# Altium schematic sheet POWER.SchDoc
size A3; SheetNumber: 1; SheetTotal: 3
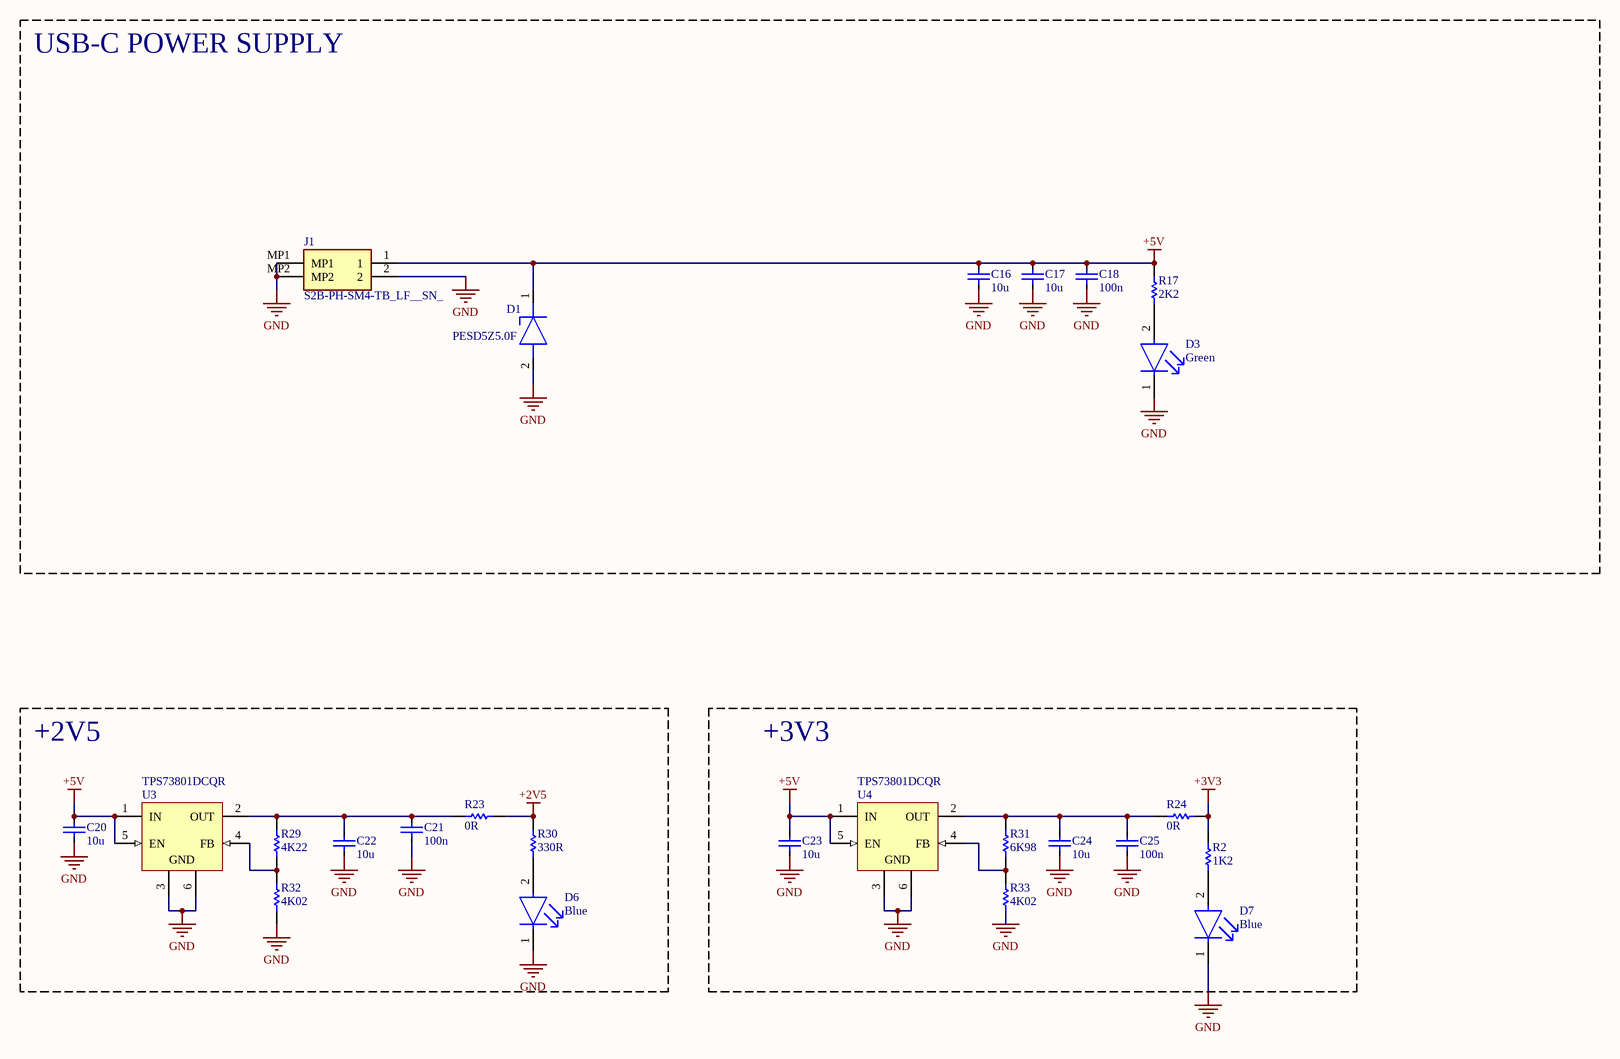
[diagram p0: POWER.SchDoc]

## Parts
C16  value 10u  [FP-C1608-080-0_1-IPC_C]  (hidden comment: C1608JB0J106K080AB)
C17  value 10u  [FP-C1608-080-0_1-IPC_C]  (hidden comment: C1608JB0J106K080AB)
C18  value 100n  [FP-C1005-050-0_05-IPC_C]  (hidden comment: C1005X7R1H104K050BB)
C20  value 10u  [FP-C1608-080-0_1-IPC_C]  (hidden comment: C1608JB0J106K080AB)
C21  value 100n  [FP-C1005-050-0_05-IPC_C]  (hidden comment: C1005X7R1H104K050BB)
C22  value 10u  [FP-C1608-080-0_1-IPC_C]  (hidden comment: C1608JB0J106K080AB)
C23  value 10u  [FP-C1608-080-0_1-IPC_C]  (hidden comment: C1608JB0J106K080AB)
C24  value 10u  [FP-C1608-080-0_1-IPC_C]  (hidden comment: C1608JB0J106K080AB)
C25  value 100n  [FP-C1005-050-0_05-IPC_C]  (hidden comment: C1005X7R1H104K050BB)
D1  PESD5Z5.0F  [SODFL1608X65N]
D3  Color: Green  [FP-LTST-C191GKT-MFG]  (hidden comment: LTST-C191GKT)
D6  Color: Blue  [FP-LTST-C191TBKT-MFG]  (hidden comment: LTST-C191TBKT)
D7  Color: Blue  [FP-LTST-C191TBKT-MFG]  (hidden comment: LTST-C191TBKT)
J1  S2B-PH-SM4-TB_LF__SN_  [S2BPHSM4TBLFSN]
R2  value 1K2  [RESC1005X40X25ML05T10]  (hidden comment: RC0402FR-071K2L)
R17  value 2K2  [RESC1005X40X25NL05T10]  (hidden comment: RC0402FR-072K2L)
R23  value 0R  [RESC1005X40X25NL05T10]  (hidden comment: RC0402FR-070RL)
R24  value 0R  [RESC1005X40X25NL05T10]  (hidden comment: RC0402FR-070RL)
R29  value 4K22  [RESC1005X40X25ML05T10]  (hidden comment: RC0402FR-074K22L)
R30  value 330R  [RESC1005X40X25ML05T10]  (hidden comment: RC0402FR-07330RL)
R31  value 6K98  [RESC1005X40X25ML05T10]  (hidden comment: RC0402FR-076K98L)
R32  value 4K02  [RESC1005X40X25ML05T10]  (hidden comment: RC0402FR-074K02L)
R33  value 4K02  [RESC1005X40X25ML05T10]  (hidden comment: RC0402FR-074K02L)
U3  TPS73801DCQR  [DCQ0006A_L]
U4  TPS73801DCQR  [DCQ0006A_L]

## Blocks framed on the sheet
USB-C POWER SUPPLY: C16-C18 D1 D3 J1 R17
+2V5: C20-C22 D6 R23 R29 R30 R32 U3
+3V3: C23-C25 D7 R2 R24 R31 R33 U4

## Nets
+2V5: R23.1 R30.1
+3V3: R2.1 R24.1
+5V: C16.1 C17.1 C18.1 C20.1 C23.1 D1.1(K) J1.1 R17.1 U3.1(IN) U3.5(EN) U4.1(IN) U4.5(EN)
GND: C16.2 C17.2 C18.2 C20.2 C21.2 C22.2 C23.2 C24.2 C25.2 D1.2(A) D3.1(C) D6.1(C) D7.1(C) J1.2 J1.MP1 J1.MP2 R32.1 R33.1 U3.3(GND) U3.6(GND) U4.3(GND) U4.6(GND)
NetC21_1: C21.1 C22.1 R23.2 R29.1 U3.2(OUT)
NetC24_1: C24.1 C25.1 R24.2 R31.2 U4.2(OUT)
NetD3_2: D3.2(A) R17.2
NetD6_2: D6.2(A) R30.2
NetD7_2: D7.2(A) R2.2
NetR29_2: R29.2 R32.2 U3.4(FB)
NetR31_1: R31.1 R33.2 U4.4(FB)

## Library data of the parts
C16 C17 C20 C22-C24 = C1608JB0J106K080AB: MLCC 10μF ±10% 6.3V JB SMD 0603; Dielectric Material: Ceramic; Case Code (Imperial): 0603; Thickness: 0.035inch; Min Operating Temperature: -25°C; Termination: SMD/SMT; Lead Free: Lead Free; Resistor Type: Ceramic; Width: 0.8mm; Voltage Rating (DC): 6.3V; Package Quantity: 4000; Tolerance: 10%; Length: 0.063inch; Series: C; Height: 0.8mm; Max Operating Temperature: 85°C; Mount: Surface Mount; RoHS Compliant: Yes; Voltage Rating: 6.3V; Case Code (Metric): 1608; Case/Package: 0603; Packaging: Tape and Reel
C18 C21 C25 = C1005X7R1H104K050BB: MLCC 100nF ±10% 50V X7R SMD 0402; Dielectric Material: Ceramic; Voltage: 50V; Min Operating Temperature: -55°C; Depth: 0.5mm; Radiation Hardening: No; RoHS Compliant: Yes; Voltage Rating (DC): 50V; Lead Free: Lead Free; Resistor Type: Ceramic; Height: 0.5mm; Dielectric: X7R; Thickness: 0.022inch; Case/Package: 0402; Case Code (Metric): 1005; Termination: SMD/SMT; Packaging: Tape and Reel; Max Operating Temperature: 125°C; Mount: Surface Mount; Package Quantity: 1; Width: 0.02inch; Weight: 2.3E-05oz; Voltage Rating: 50V; Tolerance: 10%; Construction: Flat; Case Code (Imperial): 0402; Length: 1mm; REACH SVHC: No SVHC; Series: C; Part Number: C1005X7R1H104K050BB
D1 = PESD5Z5.0F: Diode ESD (Uni-directional); Manufacturer_Name: Nexperia; Datasheet Link: https://assets.nexperia.com/documents/data-sheet/PESD5Z5_0.pdf; Height: 0.65mm; Manufacturer_Part_Number: PESD5Z5.0F; Mouser Part Number: 771-PESD5Z5.0F; Mouser Price/Stock: https://www.mouser.co.uk/ProductDetail/Nexperia/PESD5Z5.0F?qs=HNBw3F7vE2wb3Eh3cMl6Jg%3D%3D; Arrow Part Number: PESD5Z5.0F; Arrow Price/Stock: https://www.arrow.com/en/products/pesd5z5.0f/nexperia?utm_currency=USD&region=nac
D3 = CMP-22017-000029-1: LED GREEN CLEAR CHIP SMD; Power Dissipation: 100mW; Lens Color: Colorless; Number of Elements: 1; Dominant Wavelength: 569nm; Forward Voltage: 2.1V; Forward Current: 30mA; Test Current: 20mA; Viewing Angle: 130°; Wavelength: 565nm; Luminous Intensity: 12mcd; Reverse Voltage: 5V; Case/Package: 0603; Package Quantity: 1; Illumination Color: Green; Lens Style: Clear; Lens Transparency: Clear; Depth: 0.8mm; Power Rating: 100mW; Width: 0.8mm; Height: 0.55mm; Radiation Hardening: No; Case Code (Imperial): 0603; Number of Pins: 2; Length: 1.6mm; Case Code (Metric): 1608; Max Operating Temperature: 85°C; Packaging: Tape and Reel; Mount: Surface Mount; Min Operating Temperature: -55°C; Lead Free: Lead Free; Number of LEDs: 1
D6 D7 = CMP-22017-000008-1: LED BLUE CLEAR CHIP SMD; Lens Color: Colorless; Dominant Wavelength: 475nm; Forward Current: 20mA; Wavelength: 468nm; Viewing Angle: 130°; Power Dissipation: 76mW; Luminous Intensity: 180mcd; Reverse Voltage: 5V; Number of Elements: 1; Lens Style: Diffused; Forward Voltage: 3.8V; Max Power Dissipation: 75mW; Case Code (Metric): 1608; Packaging: Tape and Reel; Case/Package: 0603; Depth: 1.6mm; Mount: Surface Mount; Lead Free: Lead Free; Min Operating Temperature: -20°C; Lens Transparency: Clear; Illumination Color: Blue; Height: 0.55mm; Test Current: 20mA; Case Code (Imperial): 0603; Max Operating Temperature: 80°C; Number of Pins: 2; Length: 0.8mm; Radiation Hardening: No; Package Quantity: 1; Number of LEDs: 1; Width: 0.8mm
J1 = S2B-PH-SM4-TB_LF__SN_: Connector; Manufacturer_Name: JST (JAPAN SOLDERLESS TERMINALS); Manufacturer_Part_Number: S2B-PH-SM4-TB(LF)(SN); Datasheet Link: https://www.jst-mfg.com/product/pdf/eng/ePH.pdf; Height: 6.6mm; Mouser Part Number: N/A; Mouser Price/Stock: https://www.mouser.co.uk/ProductDetail/JST-Commercial/S2B-PH-SM4-TBLFSN?qs=QpmGXVUTftEA9IU90i0xlg%3D%3D; Arrow Part Number: S2B-PH-SM4-TB(LF)(SN); Arrow Price/Stock: https://www.arrow.com/en/products/s2b-ph-sm4-tb-lf-sn/jst-manufacturing?utm_currency=USD&region=europe
R2 = CMP-2002-07456-1: Manufacturer: Yageo / Phycomp; Part Number: RC0402FR-071K2L
R17 = CMP-2002-07567-1: Manufacturer: Yageo / Phycomp; Part Number: RC0402FR-072K2L
R23 R24 = RC0402FR-070RL: Manufacturer: Yageo / Phycomp; Part Number: RC0402FR-076K98L
R29 = CMP-2002-07711-1: Manufacturer: Yageo / Phycomp; Part Number: RC0402FR-074K22L
R30 = CMP-2002-07613-1: Manufacturer: Yageo / Phycomp; Part Number: RC0402FR-07330RL
R31 = CMP-2002-07119-1: Manufacturer: Yageo / Phycomp; Part Number: RC0402FR-076K98L
R32 R33 = CMP-2002-07710-1: Manufacturer: Yageo / Phycomp; Part Number: RC0402FR-074K02L
U3 U4 = CMP-0395-00479-2: Single Output Fast Transient Response LDO, 1 A, Adjustable 1.2 to 20 V Output, 2.2 to 20 V Input, 6-pin SOT-223 (DCQ), -40 to 125 degC, Green (RoHS & no Sb/Br); Manufacturer: Texas Instruments; Vdo(Typ)(mV): 300; SubFamily: Single Channel LDO; Vin(Min)(V): 2.2; Vin(Max)(V): 20; Iout(Max)(A): 1; Vout Adj(Min)(V): 1.2; Mounting Technology: Surface Mount; PackageVersion: 4202109/D; ComponentLink1URL: http://www.ti.com/; ComponentLink3URL: http://www.ti.com/litv/pdf/mpds098c; Eco-Plan: Green (RoHS & no Sb/Br); ComponentLink2URL: http://www.ti.com/general/docs/lit/getliterature.tsp?genericPartNumber=TPS73801&fileType=pdf; ComponentLink3Description: Package Specification; Vout Adj(Max)(V): 20; PackageReference: DCQ0006A; ComponentLink1Description: Manufacturer URL; ComponentLink2Description: Datasheet; Iq(Typ)(mA): 1; DatasheetVersion: SLVS915A; PackageDescription: 6-Pin Plastic Small Outline, Body 3.5 x 6.5 mm, Pitch 1.27 mm; PartNumber: TPS73801DCQR